# Altium project HT_SHUIHU.PrjPcb
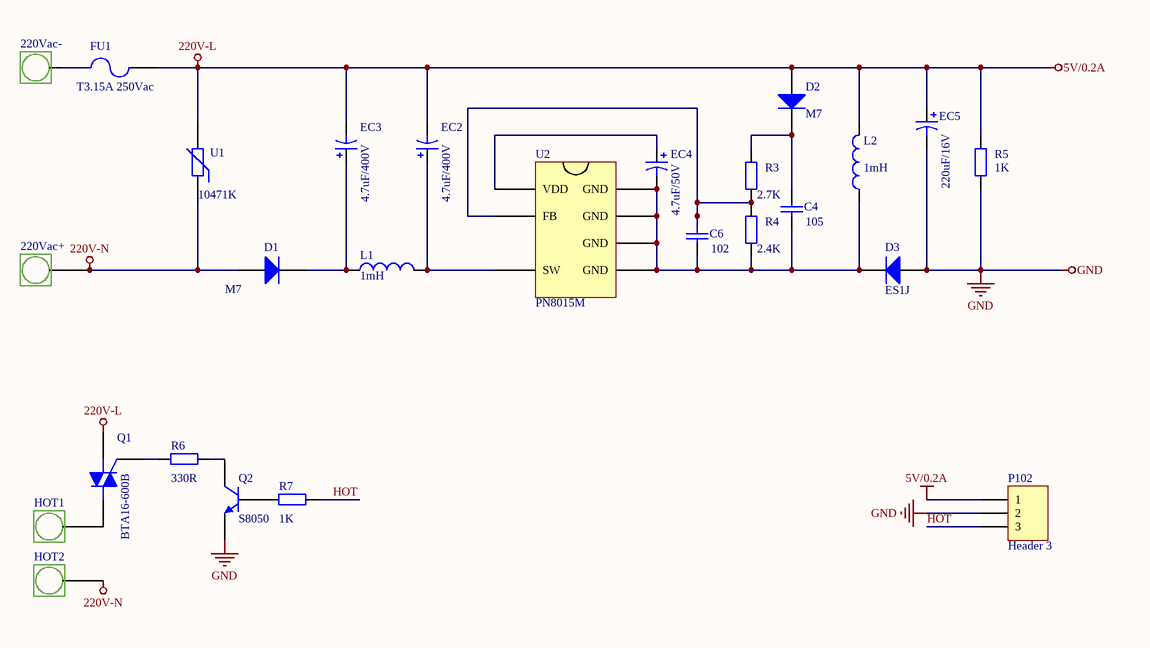
[diagram p0: POWER.SchDoc]
2 sheets, 41 parts. Net scope: global (net labels, ports and power ports of the same name join across sheets).
Board files: SHUIHU.PcbDoc, POWER.PcbDoc, HT1017-MAIN_PCB.PcbDoc
Sheets:
  POWER.SchDoc
  HT1017-MAIN.SchDoc

## Sheet POWER.SchDoc
size A4

### Parts
220Vac+  焊接点  [HanJie]  (value not drawn)
220Vac-  焊接点  [HanJie]  (value not drawn)
C4  value 105  [6-0805_N]  (hidden comment: 电容)
C6  value 102  [6-0805_N]  (hidden comment: 电容)
D1  M7  [ErJiGuan-M7]
D2  M7  [ErJiGuan-M7]
D3  ES1J  [ErJiGuan-M7]
EC2  value 4.7uF/400V  [DianRong-3.5mm]  (hidden comment: 电容)
EC3  value 4.7uF/400V  [DianRong-3.5mm]  (hidden comment: 电容)
EC4  value 4.7uF/50V  [DianRong-3.3mm]  (hidden comment: 电容)
EC5  value 220uF/16V  [DianRong-3.2mm]  (hidden comment: 电容)
FU1  T3.15A 250Vac  [BaoXianSi]
HOT1  焊接点  [HanJie]  (value not drawn)
HOT2  焊接点  [HanJie]  (value not drawn)
L1  value 1mH  [DianGan-12.5mm]  (hidden comment: 电感)
L2  value 1mH  [DianGan]  (hidden comment: 电感)
P102  Header 3  [HDR1X3]
Q1  BTA16-600B  [BTA16-600B]
Q2  S8050  [SOT-23_L]
R3  value 2.7K  [6-0805_N]  (hidden comment: 电阻)
R4  value 2.4K  [6-0805_N]  (hidden comment: 电阻)
R5  value 1K  [6-0805_N]  (hidden comment: 电阻)
R6  value 330R  [6-0805_N]  (hidden comment: 电阻)
R7  value 1K  [6-0805_N]  (hidden comment: 电阻)
U1  10471K  [YaMinDianZhu]
U2  PN8015M  [SOP7-PN8015M]

### Nets
220V-L: D2.1(A) EC2.2 EC3.2 EC5.1 FU1.2 L2.2 P102.1 Q1.1(M1) R5.2 U1.2  [also labelled 5V/0.2A]
220V-N: 220Vac+.1(P) D1.1(A) HOT2.1(P) U1.1
GND: D3.1(A) EC5.2 P102.2 Q2.2(E) R5.1
HOT: P102.3 R7.2
Net220Vac-_1: 220Vac-.1(P) FU1.1
NetC4_1: C4.1 C6.1 D3.2(K) EC4.2 L2.1 R4.1 U2.4(GND) U2.5(GND) U2.6(GND) U2.7(GND)
NetC4_2: C4.2 D2.2(K) R3.2
NetC6_2: C6.2 R3.1 R4.2 U2.2(FB)
NetD1_2: D1.2(K) EC3.1 L1.1
NetEC2_1: EC2.1 L1.2 U2.3(SW)
NetEC4_1: EC4.1 U2.1(VDD)
NetHOT1_1: HOT1.1(P) Q1.2(M2)
NetQ1_3: Q1.3(G) R6.1
NetQ2_1: Q2.1(B) R7.1
NetQ2_3: Q2.3(C) R6.2

### Library data of the parts
220Vac+ 220Vac- HOT1 HOT2 = PORT
C4 C6 = Cap: Capacitor; Published: 8-Jun-2000; LatestRevisionDate: 17-Jul-2002; LatestRevisionNote: Re-released for DXP Platform.; PackageReference: RAD-0.3; Publisher: Altium Limited; PackageDescription: Radial Cap, Thru-Hole; 2 Leads; 0.3 in Pin Spacing
D1 = Diode 1N4001: 1 Amp General Purpose Rectifier; Published: 8-Jun-2000; LatestRevisionDate: 17-Jul-2002; LatestRevisionNote: Re-released for DXP Platform.; DatasheetVersion: 1998; PackageVersion: Aug-1999; PackageReference: DO-41; Publisher: Altium Limited; PackageDescription: Diode, Axial; Body 5.2 x 2.7 mm (LxDia. max), Lead Dia. 0.86 mm (max); Code_JEDEC: DO-204-AL; ComponentLink1Description: Manufacturer Link; ComponentLink1URL: http://www.fairchildsemi.com/; ComponentLink2Description: Datasheet; ComponentLink2URL: http://www.fairchildsemi.com/ds/1N%2F1N4001.pdf; value: M7
D2 = Diode 1N4007: 1 Amp General Purpose Rectifier; Published: 8-Jun-2000; LatestRevisionDate: 17-Jul-2002; LatestRevisionNote: Re-released for DXP Platform.; DatasheetVersion: 1998; PackageVersion: Aug-1999; PackageReference: DO-41; Publisher: Altium Limited; PackageDescription: Diode, Axial; Body 5.2 x 2.7 mm (LxDia. max), Lead Dia. 0.86 mm (max); Code_JEDEC: DO-204-AL; ComponentLink1Description: Manufacturer Link; ComponentLink1URL: http://www.fairchildsemi.com/; ComponentLink2Description: Datasheet; ComponentLink2URL: http://www.fairchildsemi.com/ds/1N%2F1N4001.pdf; value: M7
D3 = Diode: Default Diode; Published: 8-Jun-2000; LatestRevisionDate: 17-Jul-2002; LatestRevisionNote: Re-released for DXP Platform.; PackageVersion: Sep-1996; PackageReference: SMC; Publisher: Altium Limited; PackageDescription: DO-214-AB/SMC; 2 C-Bend Leads; Body 7.9 x 5.9 mm, inc. leads (LxW); Code_JEDEC: DO-214-AB; value: ES1J
EC2-EC5 = Cap Pol1: Polarized Capacitor (Radial); Published: 8-Jun-2000; LatestRevisionDate: 17-Jul-2002; LatestRevisionNote: Re-released for DXP Platform.; PackageReference: RB7.6-15; Publisher: Altium Limited; PackageDescription: Polarized Capacitor (Radial); 2 Leads
FU1 = Fuse 2: Fuse; Published: 8-Jun-2000; LatestRevisionDate: 17-Jul-2002; LatestRevisionNote: Re-released for DXP Platform.; PackageReference: PIN-W2/E2.8; Publisher: Altium Limited; PackageDescription: Thru-Hole; 2 Leads; value: T3.15A 250Vac
L1 L2 = Inductor: Code_IEC: 1005; Published: 8-Jun-2000; LatestRevisionDate: 29-May-2009; LatestRevisionNote: IPC-7351 Footprint Added.; PackageReference: 0402-A; Publisher: Altium Limited; PackageDescription: Chip Inductor; Code_JEITA: 0402
P102 = Header 3: Header, 3-Pin; LatestRevisionDate: 17-Jul-2002; LatestRevisionNote: Re-released for DXP Platform.; Publisher: Altium Limited
Q1 = Triac: Silicon Bidirectional Triode Thyristor; Note: Pin 2 is electrically connected to Pin 4 (TAB); Published: 29-Sep-2000; LatestRevisionDate: 17-Jul-2002; LatestRevisionNote: Re-released for DXP Platform.; DatasheetVersion: 1999; PackageReference: 369-03; Publisher: Altium Limited; PackageDescription: TO, Thru-Hole, Vertical, Heatsink Mounted; 3 In-Line Leads; Pitch 2.28 mm; ComponentLink1Description: Manufacturer Link; ComponentLink1URL: http://www.motorola.com/
Q2 = QNPN: NPN Bipolar Transistor; Published: 8-Jun-2000; LatestRevisionDate: 29-May-2009; LatestRevisionNote: IPC-7351 Footprint Added.; PackageVersion: Aug-1999; PackageReference: SOT-23B; Publisher: Altium Limited; PackageDescription: 3-Pin SOT-23 Package 0.95 mm Pitch, 2.4 mm Lead Span; value: S8050
R3-R7 = Res2: Resistor; Published: 8-Jun-2000; LatestRevisionDate: 17-Jul-2002; LatestRevisionNote: Re-released for DXP Platform.; PackageReference: AXIAL-0.4; Publisher: Altium Limited; PackageDescription: Axial Device, Thru-Hole; 2 Leads; 0.4 in Pin Spacing
U1 = Res Varistor: Varistor (Voltage-Sensitive Resistor); Published: 24-Mar-1999; LatestRevisionDate: 29-May-2009; LatestRevisionNote: IPC-7351 Footprint Added.; PackageVersion: Mar-2003; PackageReference: 6-0805; Publisher: Altium Limited; PackageDescription: Chip Resistor 0805 Case Size; Code_IPC: RESC2012
U2 = PN8015

## Sheet HT1017-MAIN.SchDoc
size A4
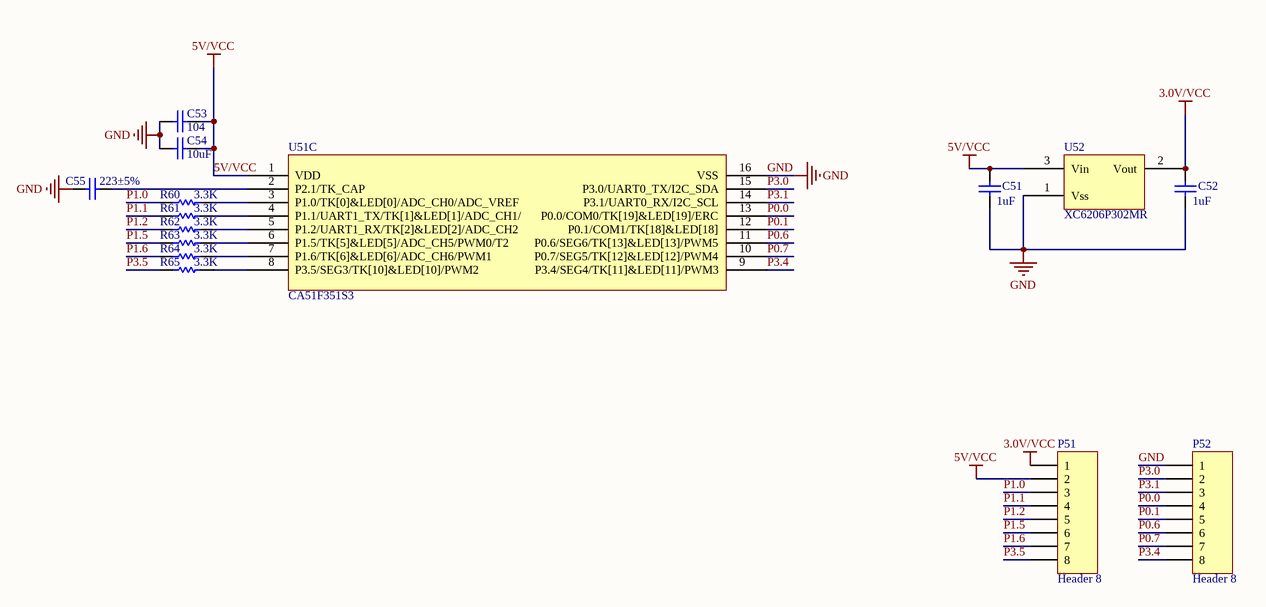
[diagram p1: HT1017-MAIN.SchDoc]

### Parts
C51  value 1uF  [C 0603_L]  (hidden comment: Cap)
C52  value 1uF  [C 0603_L]  (hidden comment: Cap)
C53  value 104  [C 0603_L]  (hidden comment: Cap)
C54  value 10uF  [C 0805_L]  (hidden comment: Cap)
C55  value 223±5%  [C 0603_L]  (hidden comment: Cap)
P51  Header 8  [HDR1X8]
P52  Header 8  [HDR1X8]
R60  value 3.3K  [R 0603_L]  (hidden comment: Res1)
R61  value 3.3K  [R 0603_L]  (hidden comment: Res1)
R62  value 3.3K  [R 0603_L]  (hidden comment: Res1)
R63  value 3.3K  [R 0603_L]  (hidden comment: Res1)
R64  value 3.3K  [R 0603_L]  (hidden comment: Res1)
R65  value 3.3K  [R 0603_L]  (hidden comment: Res1)
U51  CA51F351S3  [SOP16_L]  (part C of 3)
U52  XC6206P302MR  [SOT23-3L]

### Nets
3.0V/VCC: C52.2 P51.1 U52.2(Vout)
5V/VCC: C51.2 C53.2 C54.2 P51.2 U51.1(VDD) U52.3(Vin)
GND: C51.1 C52.1 C53.1 C54.1 C55.1 P52.1 U51.16(VSS) U52.1(Vss)
P0.0: P52.4 U51.13(P0.0/COM0/TK[19]&LED[19]/ERC)
P0.1: P52.5 U51.12(P0.1/COM1/TK[18]&LED[18])
P0.6: P52.6 U51.11(P0.6/SEG6/TK[13]&LED[13]/PWM5)
P0.7: P52.7 U51.10(P0.7/SEG5/TK[12]&LED[12]/PWM4)
P1.0: P51.3 R60.1
P1.1: P51.4 R61.1
P1.2: P51.5 R62.1
P1.5: P51.6 R63.1
P1.6: P51.7 R64.1
P3.0: P52.2 U51.15(P3.0/UART0_TX/I2C_SDA)
P3.1: P52.3 U51.14(P3.1/UART0_RX/I2C_SCL)
P3.4: P52.8 U51.9(P3.4/SEG4/TK[11]&LED[11]/PWM3)
P3.5: P51.8 R65.1
NetC55_2: C55.2 U51.2(P2.1/TK_CAP)
NetR60_2: R60.2 U51.3(P1.0/TK[0]&LED[0]/ADC_CH0/ADC_VREF)
NetR61_2: R61.2 U51.4(P1.1/UART1_TX/TK[1]&LED[1]/ADC_CH1/)
NetR62_2: R62.2 U51.5(P1.2/UART1_RX/TK[2]&LED[2]/ADC_CH2)
NetR63_2: R63.2 U51.6(P1.5/TK[5]&LED[5]/ADC_CH5/PWM0/T2)
NetR64_2: R64.2 U51.7(P1.6/TK[6]&LED[6]/ADC_CH6/PWM1)
NetR65_2: R65.2 U51.8(P3.5/SEG3/TK[10]&LED[10]/PWM2)

### Library data of the parts
C51-C55 = Cap: 电容; Published: 8-Jun-2000; LatestRevisionDate: 17-Jul-2002; LatestRevisionNote: Re-released for DXP Platform.; PackageReference: RAD-0.3; Publisher: Altium Limited; PackageDescription: Radial Cap, Thru-Hole; 2 Leads; 0.3 in Pin Spacing
P51 P52 = Header 8: Header, 8-Pin; LatestRevisionDate: 17-Jul-2002; LatestRevisionNote: Re-released for DXP Platform.; Publisher: Altium Limited
R60-R65 = Res1: 电阻; Published: 8-Jun-2000; LatestRevisionDate: 17-Jul-2002; LatestRevisionNote: Re-released for DXP Platform.; PackageReference: AXIAL-0.3; Publisher: Altium Limited; PackageDescription: Axial Device, Thru-Hole; 2 Leads; 0.3 in Pin Spacing
U52 = XC6206P302MR: 稳压IC

## Nets that join several sheets
GND: POWER (5 pins), HT1017-MAIN (8 pins)